# Altium schematic sheet Title.SchDoc: Title Page
size Letter; Date: 2019-07-18; DocumentNumber: 1; Revision: B; SheetNumber: 1; SheetTotal: 7; ProjectTitle: SDRdrum Arty Shield; PageSetup: Record=PageOptions|CenterHorizontal=True|CenterVertical=True|PrintScale=0.98|XCorrection=1.00|YCorrection=1.00|PrintKind=2|BorderSize=5000000|LeftOffset=0|BottomOffset=0|Orientation=2|PaperLength=1000|PaperWidth=1000|Scale=100|PaperSource=7|PrintQuality=-3|MediaType=1|DitherType=10|PrintScaleMode=1|PaperKind=Tabloid|PaperIndex=3
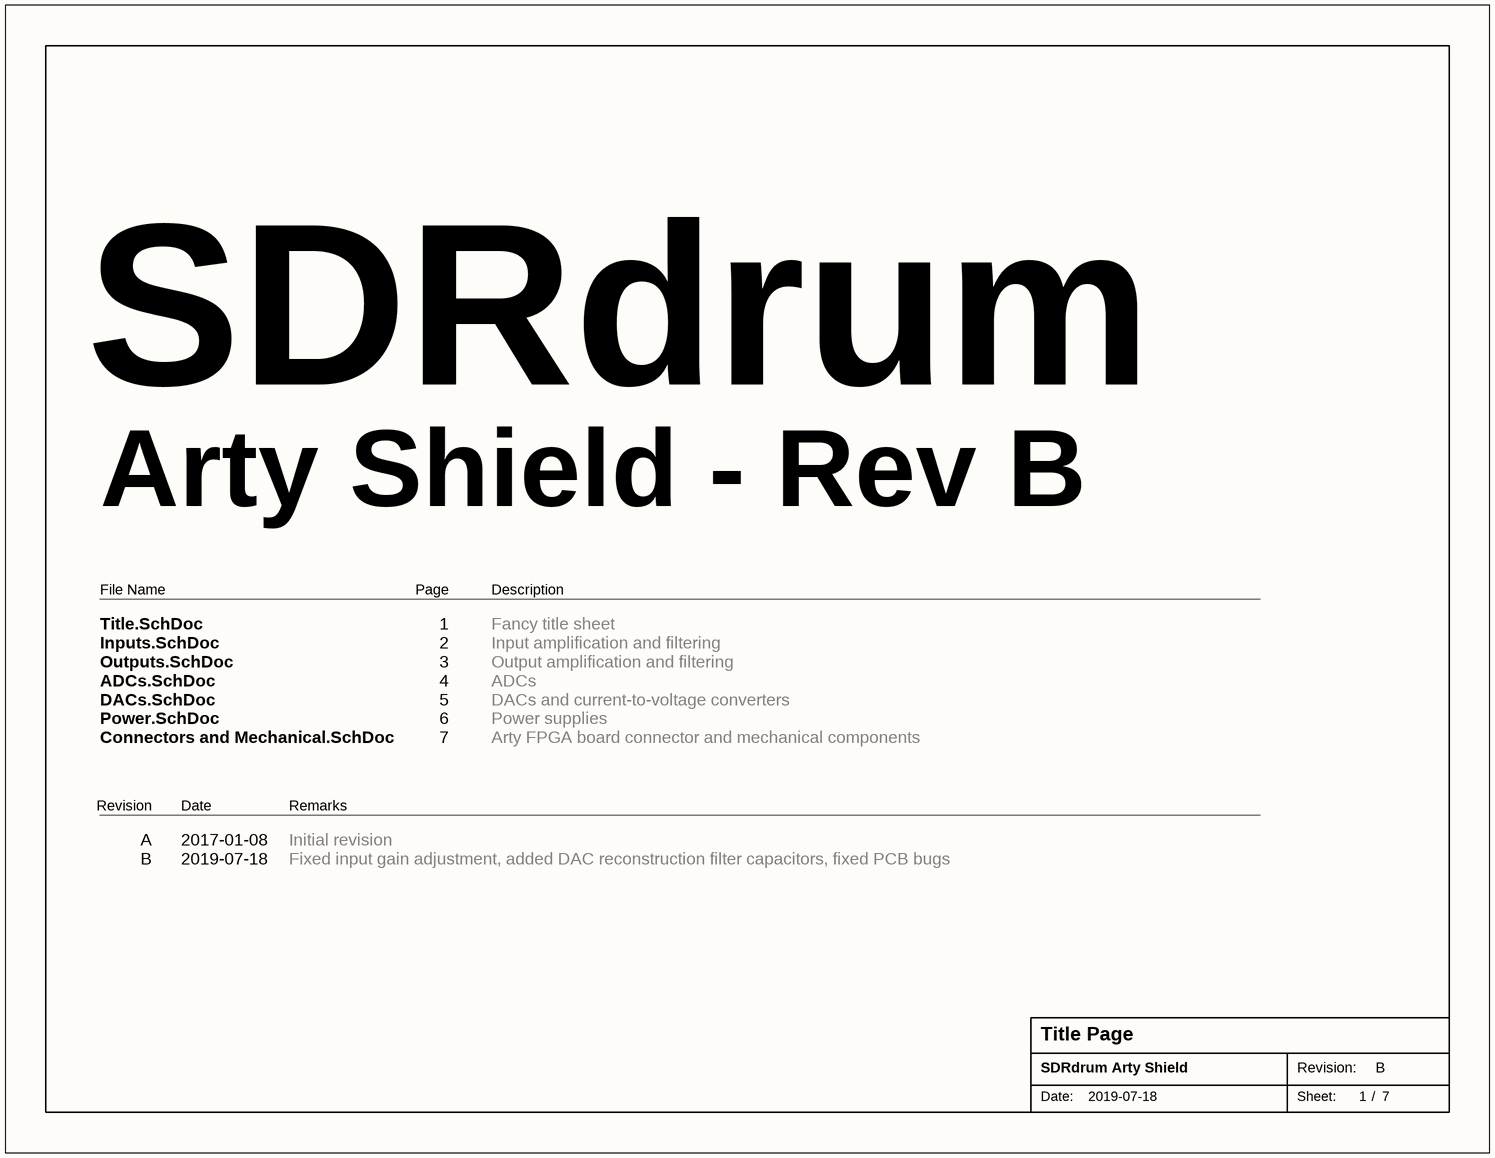
[diagram p0: Title.SchDoc]

## Notes on the sheet
- SDRdrum
- Arty Shield - Rev B
- File Name
- Page
- Description
- Title.SchDoc
  Inputs.SchDoc
  Outputs.SchDoc
  ADCs.SchDoc
  DACs.SchDoc
  Power.SchDoc
  Connectors and Mechanical.SchDoc
- 1
  2
  3
  4
  5
  6
  7
- Fancy title sheet
  Input amplification and filtering
  Output amplification and filtering
  ADCs
  DACs and current-to-voltage converters
  Power supplies
  Arty FPGA board connector and mechanical components
- Revision
- Date
- Remarks
- A
  B
- 2017-01-08
  2019-07-18
- Initial revision
  Fixed input gain adjustment, added DAC reconstruction filter capacitors, fixed PCB bugs
- Date:
- Revision:
- Sheet:
- /